# EAGLE design IFB-40004-R02 - I2C_Toggle_Switch (EAGLE 9.6.2)
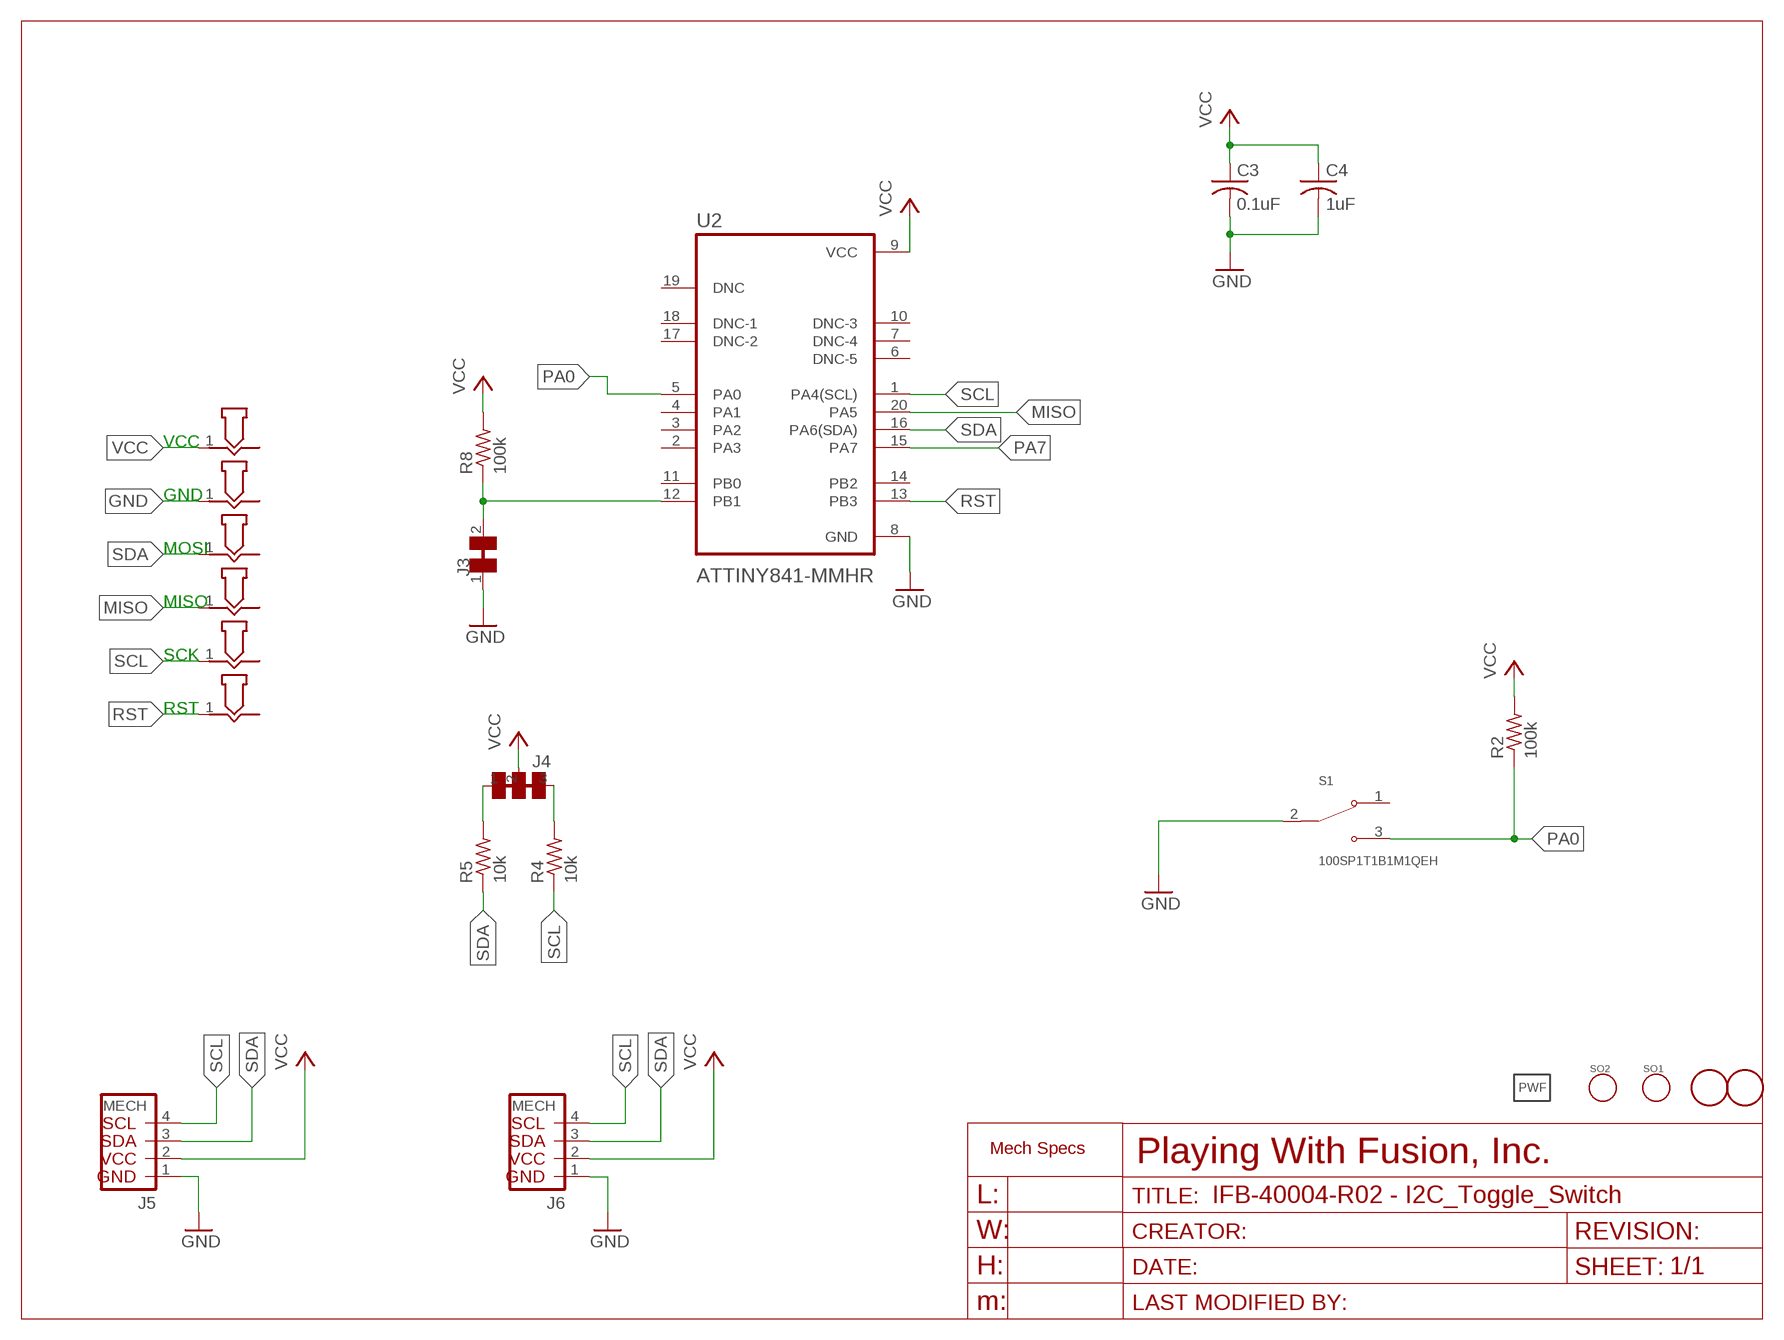
[diagram p0: schematic, sheet 1]

## Parts
C3  0.1uF  C-USC0603K  [C0603K]
C4  1uF  C-USC0603K  [C0603K]
GND  POGO_PAD  [P50_POGO_BOARD_CONTACT_12MIL]
J3  CUTTABLE_JUMPER  [SMT_CUTTABLE_JUMPER]
J4  CUT_JUMPER_2X  [SMT_2X_CUTTABLE_JUMPER]
J5  QWIICSIDE  [SM04B-SRSS-TB]
J6  QWIICSIDE  [SM04B-SRSS-TB]
LOGO1  PWF_LOGOPWF-5MM-SS  [LOGO_5MM_STEIN]
MISO  POGO_PAD  [P50_POGO_BOARD_CONTACT_12MIL]
MOSI  POGO_PAD  [P50_POGO_BOARD_CONTACT_12MIL]
R2  100k  R-US_R0603  [R0603]
R4  10k  R-US_R0603  [R0603]
R5  10k  R-US_R0603  [R0603]
R8  100k  R-US_R0603  [R0603]
RST  POGO_PAD  [P50_POGO_BOARD_CONTACT_12MIL]
S1  100SP1T1B1M1QEH  [SW_100SP1T1B1M1QEH]
SCK  POGO_PAD  [P50_POGO_BOARD_CONTACT_12MIL]
SO1  STAND_OFFNO4_TIGHT  [STANDOFF_NO4_TIGHT]
SO2  STAND_OFFNO4_TIGHT  [STANDOFF_NO4_TIGHT]
U2  ATTINY841-MMHR  [QFN45P300X300X85-21N]
U$2  FIDUCIAL  [FIDUCIAL_1MM]
U$3  FIDUCIAL  [FIDUCIAL_1MM]
VCC  POGO_PAD  [P50_POGO_BOARD_CONTACT_12MIL]

## Nets
GND: C3.2 C4.2 GND.1 J3.1 J5.1 J6.1 S1.2 U2.8(GND)
MISO: MISO.1 U2.20(PA5)
N$1: J3.2 R8.1 U2.12(PB1)
N$2: J4.1 R5.2
N$3: J4.3 R4.2
PA0: R2.1 S1.3 U2.5(PA0)
PA7: U2.15(PA7)
RST: RST.1 U2.13(PB3)
SCL: J5.4 J6.4 R4.1 SCK.1 U2.1(PA4(SCL))
SDA: J5.3 J6.3 MOSI.1 R5.1 U2.16(PA6(SDA))
VCC: C3.1 C4.1 J4.2 J5.2 J6.2 R2.2 R8.2 U2.9(VCC) VCC.1
Unconnected: J5.MECH1(MECH) J5.MECH2(MECH) J6.MECH1(MECH) J6.MECH2(MECH) S1.1 U2.2(PA3) U2.3(PA2) U2.4(PA1) U2.6(DNC-5) U2.7(DNC-4) U2.10(DNC-3) U2.11(PB0) U2.14(PB2) U2.17(DNC-2) U2.18(DNC-1) U2.19(DNC)

## Notes on the sheet
- VCC
- GND
- MOSI
- MISO
- SCK
- RST

## Library data of the parts
C3 C4 = rcl:C-US: CAPACITOR, American symbol; SPICEPREFIX: C
GND MISO MOSI RST SCK VCC = PlayingWithFusion_Breakout-Lib:POGO_PAD
J3 = PlayingWithFusion_Breakout-Lib:CUTTABLE_JUMPER
J4 = PlayingWithFusion_Breakout-Lib:CUT_JUMPER_2X
J5 J6 = PlayingWithFusion_JST:QWIIC
LOGO1 = PlayingWithFusion_Logo:PWF_LOGO
R2 R4 R5 R8 = rcl:R-US_: RESISTOR, American symbol; SPICEPREFIX: R
S1 = 100SP1T1B1M1QEH:100SP1T1B1M1QEH: Toggle Switch SPDT Panel Mount Check availability <https://pricing.snapeda.com/parts/100SP1T1B1M1QEH/E-Switch/view-part?ref=eda>; AVAILABILITY: In Stock; DESCRIPTION: Toggle Switch, 100 Series, SPDT, ON-NONE-ON, Sealed, 5A, 120VAC, 28VDC, Solder; MF: E-Switch; MP: 100SP1T1B1M1QEH; PACKAGE: None; PRICE: None; PURCHASE-URL: https://pricing.snapeda.com/search/part/100SP1T1B1M1QEH/?ref=eda
SO1 SO2 = PlayingWithFusion_Breakout-Lib:STAND_OFF: Stand Off This is the mechanical footprint for a #4 phillips button head screw. Use the keepout ring to avoid running the screw head into surrounding components. SKU : PRT-00447
U2 = ATTINY841-MMHR:ATTINY841-MMHR: None Check availability <https://pricing.snapeda.com/parts/ATTINY841-MMHR/Microchip/view-part?ref=eda>; AVAILABILITY: In Stock; DESCRIPTION: AVR AVR® ATtiny Microcontroller IC 8-Bit 16MHz 8KB (8K x 8) FLASH 20-VQFN (3x3); MF: Microchip; MP: ATTINY841-MMHR; PACKAGE: DFN-20 Microchip; PRICE: None; PURCHASE-URL: https://pricing.snapeda.com/search/part/ATTINY841-MMHR/?ref=eda
U$2 U$3 = PlayingWithFusion_Breakout-Lib:FIDUCIAL: For use by pick and place machines to calibrate the vision/machine, 1mm By microbuilder.eu

## Board
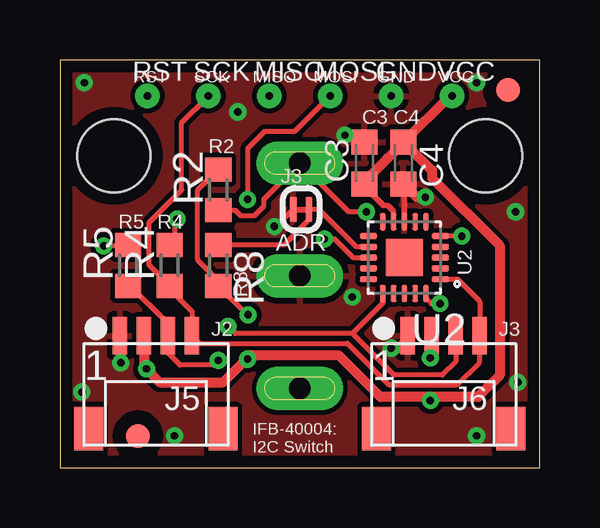
[diagram p1: board, top side]
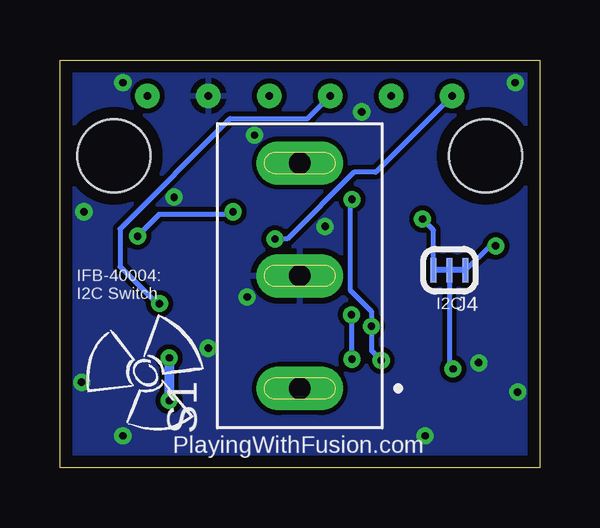
[diagram p2: board, bottom side, seen from below]

Size 20 x 17 mm. Coordinates in mm from the lower left corner, seen from the top.
Outline: 0,0 20,0 20,17 0,17 0,0
Copper layers (1*16): Top 0.035mm / dielectric 1.5mm / Bottom 0.035mm
Design rules "default *": minimum track width 8mil, minimum drill 12mil, track to track 8mil, track to pad 8mil, pad to pad 8mil, via to via 8mil, smd to smd 8mil, copper to edge 20mil, drill to drill 6mil, minimum pad ring 10mil, minimum via ring 8mil, stop-mask expansion 4mil, vias tented up to drill 17mil, thermal gap 10mil

### Footprints (pad centres in the part's own frame; a part is rotated, then mirrored left to right if it is on the bottom)
C0603K = smd 1.05 x 1.08: 1 -0.875,0; 2 0.875,0
P50_POGO_BOARD_CONTACT_12MIL = drill 0.305 pad 1.016: 1 0,0
SMT_CUTTABLE_JUMPER = smd 0.254 x 1.016: 1 -0.33,0; 2 0.33,0
SMT_2X_CUTTABLE_JUMPER = smd 0.254 x 1.016: 1 -0.66,0; 2 0,0; 3 0.66,0
SM04B-SRSS-TB = smd 0.6 x 1.55: 1 1.5,0; 2 0.5,0; 3 -0.5,0; 4 -1.5,0 | smd 1.2 x 1.8: MECH1 2.8,3.875; MECH2 -2.8,3.875
R0603 = smd 1 x 1.1: 1 -0.85,0; 2 0.85,0
SW_100SP1T1B1M1QEH = drill 0.91 pad 1.81 long: 1 -4.7,0; 2 0,0; 3 4.7,0
STANDOFF_NO4_TIGHT = hole 3.048: 0,0
QFN45P300X300X85-21N = smd 0.72 x 0.24: 1 -1.495,0.9; 2 -1.495,0.45; 3 -1.495,0; 4 -1.495,-0.45; 5 -1.495,-0.9; 11 1.495,-0.9; 12 1.495,-0.45; 13 1.495,0; 14 1.495,0.45; 15 1.495,0.9 | smd 0.24 x 0.72: 6 -0.9,-1.495; 7 -0.45,-1.495; 8 0,-1.495; 9 0.45,-1.495; 10 0.9,-1.495; 16 0.9,1.495; 17 0.45,1.495; 18 0,1.495; 19 -0.45,1.495; 20 -0.9,1.495 | smd 1.55 x 1.55: 21 0,0
FIDUCIAL_1MM = smd 1 x 1: 1 0,0

### Placement (x,y rotation side)
C3  12.7,12.7 90 top
C4  14.33,12.7 270 top
GND  13.81,15.5 0 top
J3  10.06,10.77 0 top
J4  3.76,8.23 180 bottom
J5  4,5.5 180 top
J6  16,5.5 180 top
LOGO1  16.46,3.96 0 bottom
MISO  8.73,15.5 0 top
MOSI  11.27,15.5 0 top
R2  6.6,11.58 90 top
R4  4.57,8.43 90 top
R5  2.84,8.43 90 top
R8  6.6,8.43 270 top
RST  3.65,15.5 0 top
S1  10,8 90 bottom
SCK  6.19,15.5 0 top
SO1  2.25,13 0 top
SO2  17.75,13 0 top
U2  14.36,8.75 180 top
U$2  18.69,15.75 0 top
U$3  3.25,1.32 0 top
VCC  16.35,15.5 0 top

### Tracks (layer width: path | path; a pad name or v marks a point on that pad's centre or on a via)
GND  (via drill 0.3)
  Top 0.203: J3.1 9.02,10.06 v8.94,10.06
  Top 0.229: U2.8 14.36,11.79 C4.2
  Top 0.406: J5.1 2.5,4.41 v2.54,4.37 | J6.1 14.5,5.36 14.12,4.98 v13.82,4.98 | C3.2 12.46,13.82 v11.89,13.87 | C4.2 14.88,11.27 v15.24,11.27
  other vias: 1.02,16.05 7.42,14.83 17.37,16.05 19,10.67 17.37,1.32 4.78,1.32 19.1,3.56 12.19,7.11 0.91,3.15
  pour Bottom: 20,0 0,0 0,17 20,17
  pour Top: 20,0 0,0 0,17 20,17
MISO  (via drill 0.3)
  Top 0.203: U2.20 15.26,7.06 15.48,6.83 v15.85,6.83
  Bottom 0.203: v15.85,6.83 15.95,6.83 17.5,8.38 17.5,9.95 12.9,14.55 9.68,14.55 MISO.1
N$1
  Top 0.203: U2.12 12.36,9.21 10.79,10.77 J3.2 10.39,10.34 9.33,9.28 R8.1
N$2  (via drill 0.3)
  Top 0.203: R5.2 2.81,9.25 v1.83,9.25
  Bottom 0.203: J4.1 2.08,9.25 v1.83,9.25
N$3  (via drill 0.3)
  Top 0.203: v4.88,10.36 4.78,10.26 4.78,9.65 4.57,9.45 R4.2
  Bottom 0.203: J4.3 4.42,9.91 v4.88,10.36
PA0  (via drill 0.3)
  Top 0.203: v12.78,10.67 12.03,10.67 S1.3 8.51,11.21 8.51,10.9 8.11,10.5 7.54,10.5 7.31,10.73 R2.1 | v16.76,9.65 U2.5
  Bottom 0.203: v12.78,10.67 12.89,10.57 15.85,10.57 v16.76,9.65
RST  (via drill 0.3)
  Top 0.203: v11.04,9.53 11.44,9.53 12.22,8.76 U2.13
  Bottom 0.203: v11.04,9.53 10.52,9.53 7.73,12.32 6.83,12.32 RST.1
SCL
  Top 0.203: U2.1 16.57,7.86 17.5,6.92 J6.4 17.5,4.39 16.56,3.45 13.72,3.45 13.21,3.96 13.21,3.97 11.99,5.18 5.82,5.18 J5.4 5.51,6.5 4.57,7.44 R4.1 4.57,7.6 3.72,8.45 3.72,10.21 5.08,11.58 5.08,14.39 SCK.1
SDA  (via drill 0.3)
  Top 0.203: 4.5,6.03 J5.3 | v7.01,5.89 7.32,5.59 12.19,5.59 | MOSI.1 9.78,14.01 8.53,14.01 7.82,13.31 v7.82,11.19 | J5.3 4.5,6.01 2.92,7.58 R5.1 | J6.3 16.5,4.41 15.95,3.86 13.92,3.86 12.19,5.59 | U2.16 13.46,6.86 12.19,5.59 | J5.3 4.5,4.79 5.01,4.28 6.41,4.28 v6.6,4.47
  Bottom 0.203: v7.82,11.19 7.88,11.12 7.88,7.38 7.01,6.5 v7.01,5.89 7.01,4.88 v6.6,4.47
VCC  (via drill 0.3)
  Top 0.203: v7.85,6.37 7.81,6.37 R8.2 6.6,7.8 5.75,8.66 5.75,11.58 R2.2 | v7.82,4.52 7.82,4.57 7.92,4.67
  Top 0.229: C3.1 12.7,11.72 13.5,10.93 13.68,10.93 13.91,10.69 U2.9
  Top 0.406: 15.54,2.95 17.43,2.95 18.34,3.85 18.34,9.25 15.52,12.07 15.52,12.39 C4.1 | 15.54,2.95 13.37,2.95 11.64,4.67 7.92,4.67 6.81,3.56 4.17,3.56 v3.61,4.12 3.5,4.22 J5.2 3.49,5.49 | C4.1 13.65,12.9 13.65,12.88 12.7,11.94 C3.1 | C4.1 16.25,15.5 VCC.1 | J6.2 15.5,4.63 v15.44,4.57 | v15.44,2.79 15.44,2.85 15.54,2.95
  Bottom 0.203: v7.82,4.52 7.85,4.54 v7.85,6.37 | J4.2 3.76,4.27 v3.61,4.12
  Bottom 0.406: v15.44,4.57 v15.44,2.79

### Text on the board
tPlace: RST | SCK | MISO | MOSI | GND | VCC | C3 | C4 | R2 | R5 | R4 | ADR | U2 | R8 | J2 | J3 | IFB-40004: / I2C Switch
bPlace: I2C | IFB-40004: / I2C Switch | PlayingWithFusion.com